# EAGLE schematic ups_unit (EAGLE 9.5.2)
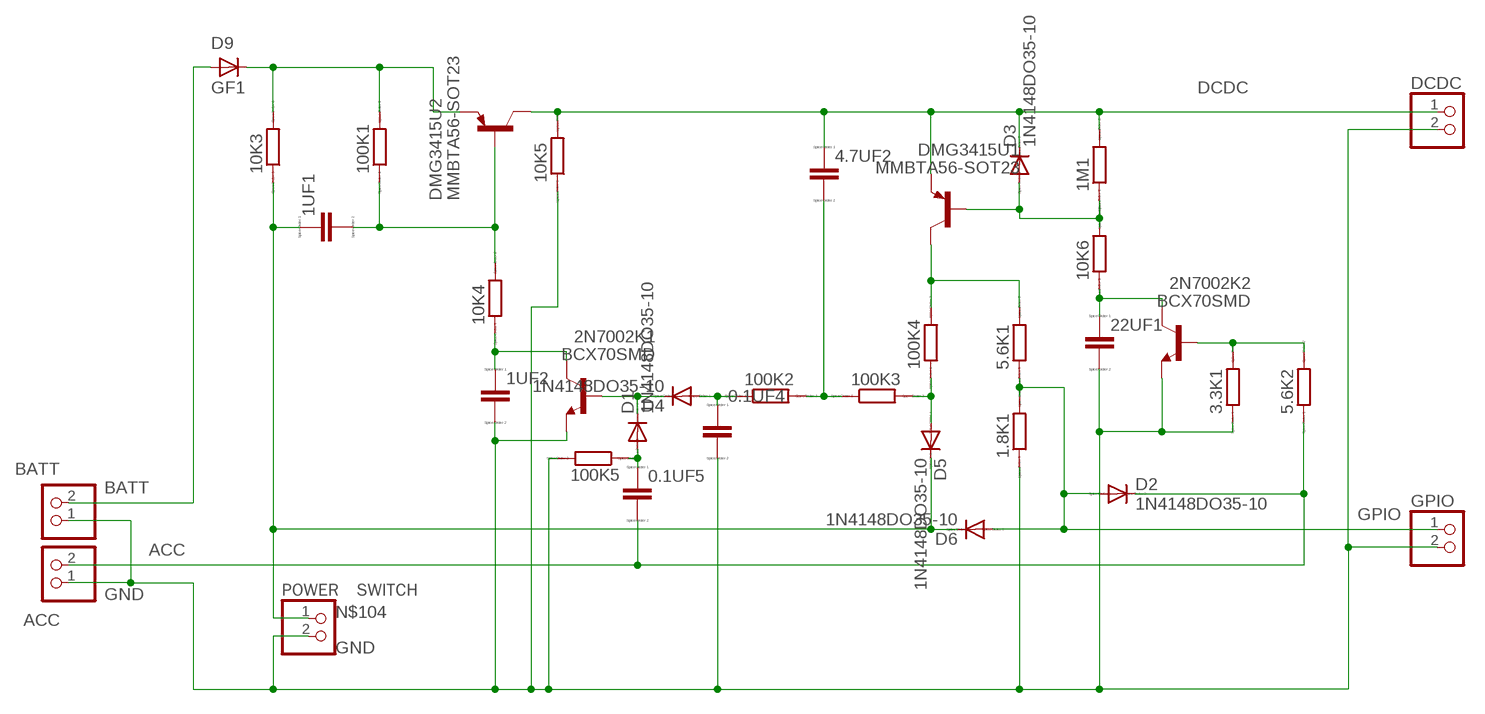
[diagram p0: schematic, sheet 1]

## Parts
0.1UF4  CC1206  [C1206]
0.1UF5  CC1206  [C1206]
1.8K1  RR1206  [R1206]
1M1  RR1206  [R1206]
1UF1  CC0603  [C0603]
1UF2  CC0603  [C0603]
2N7002K1  BCX70SMD  [SOT23]
2N7002K2  BCX70SMD  [SOT23]
3.3K1  RR1206  [R1206]
4.7UF2  CC2012  [C2012]
5.6K1  RR1206  [R1206]
5.6K2  RR1206  [R1206]
10K3  RR1206  [R1206]
10K4  RR1206  [R1206]
10K5  RR1206  [R1206]
10K6  RR1206  [R1206]
22UF1  C  [C0805]
100K1  RR1206  [R1206]
100K2  RR1206  [R1206]
100K3  RR1206  [R1206]
100K4  RR1206  [R1206]
100K5  RR1206  [R1206]
ACC  PINHD-1X2  [1X02]
BATT  PINHD-1X2  [1X02]
D1  1N4148DO35-10  [DO35-10]
D2  1N4148DO35-10  [DO35-10]
D3  1N4148DO35-10  [DO35-10]
D4  1N4148DO35-10  [DO35-10]
D5  1N4148DO35-10  [DO35-10]
D6  1N4148DO35-10  [DO35-10]
D9  GF1  [SMA-DO214AC]
DCDC  PINHD-1X2  [1X02]
DMG3415U1  MMBTA56-SOT23  [SOT23]
DMG3415U2  MMBTA56-SOT23  [SOT23]
GPIO  PINHD-1X2  [1X02]
POWER　SWITCH  PINHD-1X2  [1X02]

## Nets
ACC: 0.1UF5.2 5.6K2.1 ACC.2 D2.C
BATT: BATT.2 D9.A
DCDC: 1M1.2 4.7UF2.1 10K5.2 D3.C DCDC.1 DMG3415U1.2(E) DMG3415U2.3(C)
GND: 0.1UF4.2 1.8K1.1 1UF2.2 2N7002K1.2(E) 2N7002K2.2(E) 3.3K1.1 10K5.1 22UF1.2 100K5.2 ACC.1 BATT.1 DCDC.2 GPIO.2 POWER　SWITCH.2
GPIO: 1.8K1.2 5.6K1.1 D2.A D6.A GPIO.1
N$1: 2N7002K2.3(C) 10K6.1 22UF1.1
N$103: 10K3.2 100K1.2 D9.K(C) DMG3415U2.2(E)
N$104: 1UF1.1 10K3.1 D5.C D6.C POWER　SWITCH.1
N$105: 1UF1.2 10K4.2 100K1.1 DMG3415U2.1(B)
N$106: 1UF2.1 2N7002K1.3(C) 10K4.1
N$107: 2N7002K1.1(B) D1.C D4.C
N$108: 0.1UF4.1 100K2.1 D4.A
N$110: 4.7UF2.2 100K2.2 100K3.1
N$111: 5.6K1.2 100K4.2 DMG3415U1.3(C)
N$113: 100K3.2 100K4.1 D5.A
N$115: 0.1UF5.1 100K5.1 D1.A
N$116: 1M1.1 10K6.2 D3.A DMG3415U1.1(B)
N$118: 2N7002K2.1(B) 3.3K1.2 5.6K2.2

## Library data of the parts
0.1UF4 0.1UF5 1UF1 1UF2 4.7UF2 22UF1 = eagle-ltspice:C: CAPACITOR, European symbol; SPICEMODEL: NONE; SPICEPREFIX: C
1.8K1 1M1 3.3K1 5.6K1 5.6K2 10K3-10K6 100K1-100K5 = eagle-ltspice:R: RESISTOR, European symbol; SPICEMODEL: NONE; SPICEPREFIX: R
2N7002K1 2N7002K2 = transistor-npn:BCX70*: NPN Transistor
ACC BATT DCDC GPIO POWER　SWITCH = pinhead:PINHD-1X2: PIN HEADER
D1-D6 = diode:1N4148: DIODE high speed (Philips)
D9 = diode:GF1: DIODE
DMG3415U1 DMG3415U2 = transistor-pnp:*-?: PNP Transistor

## Net classes
0 default: width 0.4 mm, drill 0.3 mm, clearance 0.3 mm